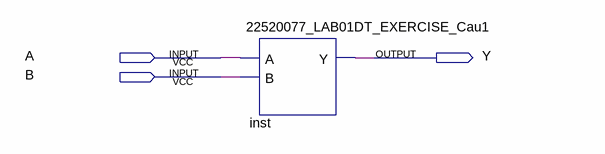
[diagram p0: schematic sheet]
// Quartus schematic LAB01DT_EXERCISE_blockdiagram1.bdf as structural Verilog: 1 symbols, 3 pins
module LAB01DT_EXERCISE_blockdiagram1 (
  input  A,
  input  B,
  output Y
);

  \22520077_LAB01DT_EXERCISE_Cau1  inst (.A(A), .B(B), .Y(Y));
endmodule
